# Altium schematic sheet 48V_0.5A_Converter.SchDoc
size A
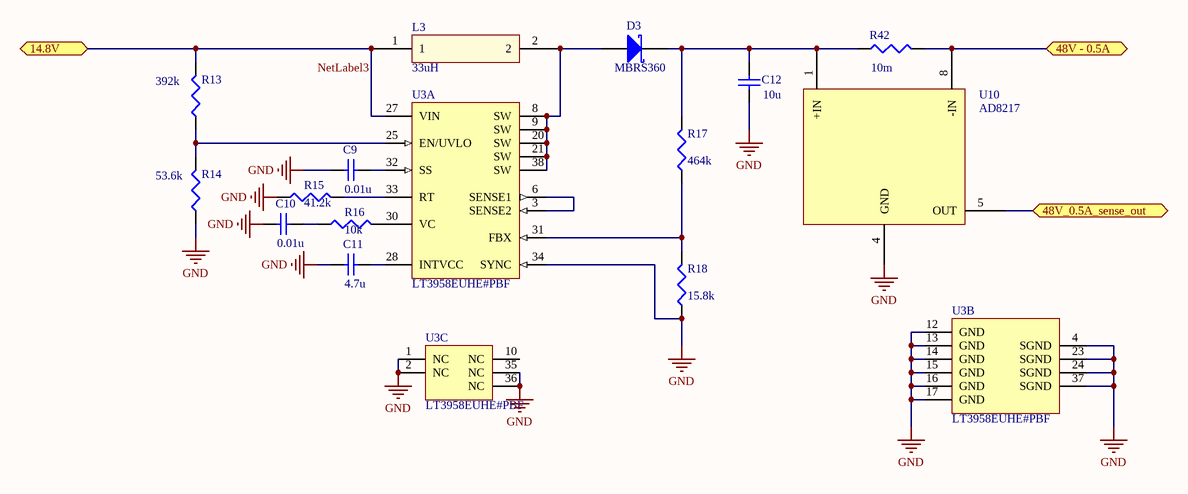
[diagram p0: 48V_0.5A_Converter.SchDoc]

## Parts
C9  value 0.01u  [C1206]  (hidden comment: Cap Semi)
C10  value 0.01u  [C1206]  (hidden comment: Cap Semi)
C11  value 4.7u  [C1206]  (hidden comment: Cap Semi)
C12  value 10u  [C1206]  (hidden comment: Cap Semi)
D3  MBRS360  [SMB]
L3  33uH  [INDP125125X45N]
R13  value 392k  [J1-0603]  (hidden comment: Res3)
R14  value 53.6k  [J1-0603]  (hidden comment: Res3)
R15  value 41.2k  [J1-0603]  (hidden comment: Res3)
R16  value 10k  [J1-0603]  (hidden comment: Res3)
R17  value 464k  [J1-0603]  (hidden comment: Res3)
R18  value 15.8k  [J1-0603]  (hidden comment: Res3)
R42  value 10m  [J1-0603]  (hidden comment: Res3)
U3  LT3958EUHE#PBF  [LT-UHE-36-V-UHE28MA_V]  (parts A,B,C of 3)
U10  AD8217  [TSOP65P490X110-8N]

## Ports
14.8V, 48V - 0.5A, 48V_0.5A_sense_out

## Nets
GND: C9.1 C10.1 C11.1 C12.1 R14.1 R15.1 R18.1 U3.1(NC) U3.2(NC) U3.4(SGND) U3.12(GND) U3.13(GND) U3.14(GND) U3.15(GND) U3.16(GND) U3.17(GND) U3.23(SGND) U3.24(SGND) U3.34(SYNC) U3.35(NC) U3.36(NC) U3.37(SGND) U10.4(GND)
14.8V: L3.1 R13.2 U3.27(VIN) ; port 14.8V
48V - 0.5A: R42.2 U10.8(-IN) ; port 48V - 0.5A
48V_0.5A_sense_out: U10.5(OUT) ; port 48V_0.5A_sense_out
NetC9_2: C9.2 U3.32(SS)
NetC10_2: C10.2 R16.1
NetC11_2: C11.2 U3.28(INTVCC)
NetC12_2: C12.2 D3.2(K) R17.2 R42.1 U10.1(+IN)
NetD3_1: D3.1(A) L3.2 U3.8(SW) U3.9(SW) U3.20(SW) U3.21(SW) U3.38(SW)
NetR13_1: R13.1 R14.2 U3.25(EN/UVLO)
NetR15_2: R15.2 U3.33(RT)
NetR16_2: R16.2 U3.30(VC)
NetR17_1: R17.1 R18.2 U3.31(FBX)
NetU3_3: U3.3(SENSE2) U3.6(SENSE1)

Not connected (* = marked no-connect by the designer): U3 10(NC)

## Notes on the sheet
- Labels drawn without touching a wire or pin: NetLabel3

## Library data of the parts
C9-C12 = Cap Semi: Capacitor (Semiconductor SIM Model); Published: 8-Jun-2000; LatestRevisionDate: 29-May-2009; LatestRevisionNote: IPC-7351 Footprint Added.; PackageReference: C1206; Publisher: Altium Limited; PackageDescription: Chip Capacitor
D3 = D Schottky: Schottky Diode; Published: 8-Jun-2000; LatestRevisionDate: 17-Jul-2002; LatestRevisionNote: Re-released for DXP Platform.; PackageReference: SMB; Publisher: Altium Limited; PackageDescription: DO-214-AA/SMB; 2 C-Bend Leads; Body 5.3 x 3.6 mm, inc. leads (LxW); Code_JEDEC: DO-214-AA
L3 = IHLP-6767DZ-11: 33uH Inductors
R13-R18 R42 = Res3: Resistor; Published: 8-Jun-2000; LatestRevisionDate: 29-May-2009; LatestRevisionNote: IPC-7351 Footprint Added.; PackageReference: J1-0603; Publisher: Altium Limited; PackageDescription: Chip Resistor
U3 = LT3958EUHE#PBF: High Input Voltage, Boost, Flyback, SEPIC and Inverting Converter, 36-pin QFN (UHE-36-UHE28MA), -40 to 125 degC, Pb-Free; Manufacturer: Linear Technology; Frequency Adjust Range: 100kHz - 1MHz; Number of Outputs: 1; PackageVersion: Rev. D, 02/2012; PackageReference: UHE-36; PackageDescription: 28-Pin Plastic QFN, Body 5 x 6 mm, Pitch 0.5 mm; Supplier 1: Digi-Key; Supplier Part Number 1: LT3958EUHE#PBF-ND; Supplier 2: Farnell; Supplier Part Number 2: 2294964; Supplier 3: Newark; Supplier Part Number 3: 78R8466; RoHS: TRUE; Mounting Technology: Surface Mount; PartNumber: LT3958EUHE#PBF; ComponentLink1Description: Manufacturer URL; ComponentLink1URL: http://www.linear.com/; ComponentLink2Description: Datasheet; ComponentLink2URL: http://cds.linear.com/docs/en/datasheet/3958f.pdf; ComponentLink3Description: Package Specification; ComponentLink3URL: http://cds.linear.com/docs/en/packaging/QFN_28_05-08-1836.pdf
U10 = Component_1: Current Shunt Moniter